# EasyEDA Pro project ProPrj_LuckfoxLyraLCD_2025-09-14.epro

# Schematic Schematic_luckfox_lyra
Board Name: LCDBoard_luckfox_lyra; Create Date: 2025-08-31; Page Name: LCD_driver; Project Name: LCDBoard4Rockchip; Schematic Name: Schematic_luckfox_lyra; Update Date: 2025-09-04; Company: 嘉立创EDA; Page Size: A4; Version: V1.0
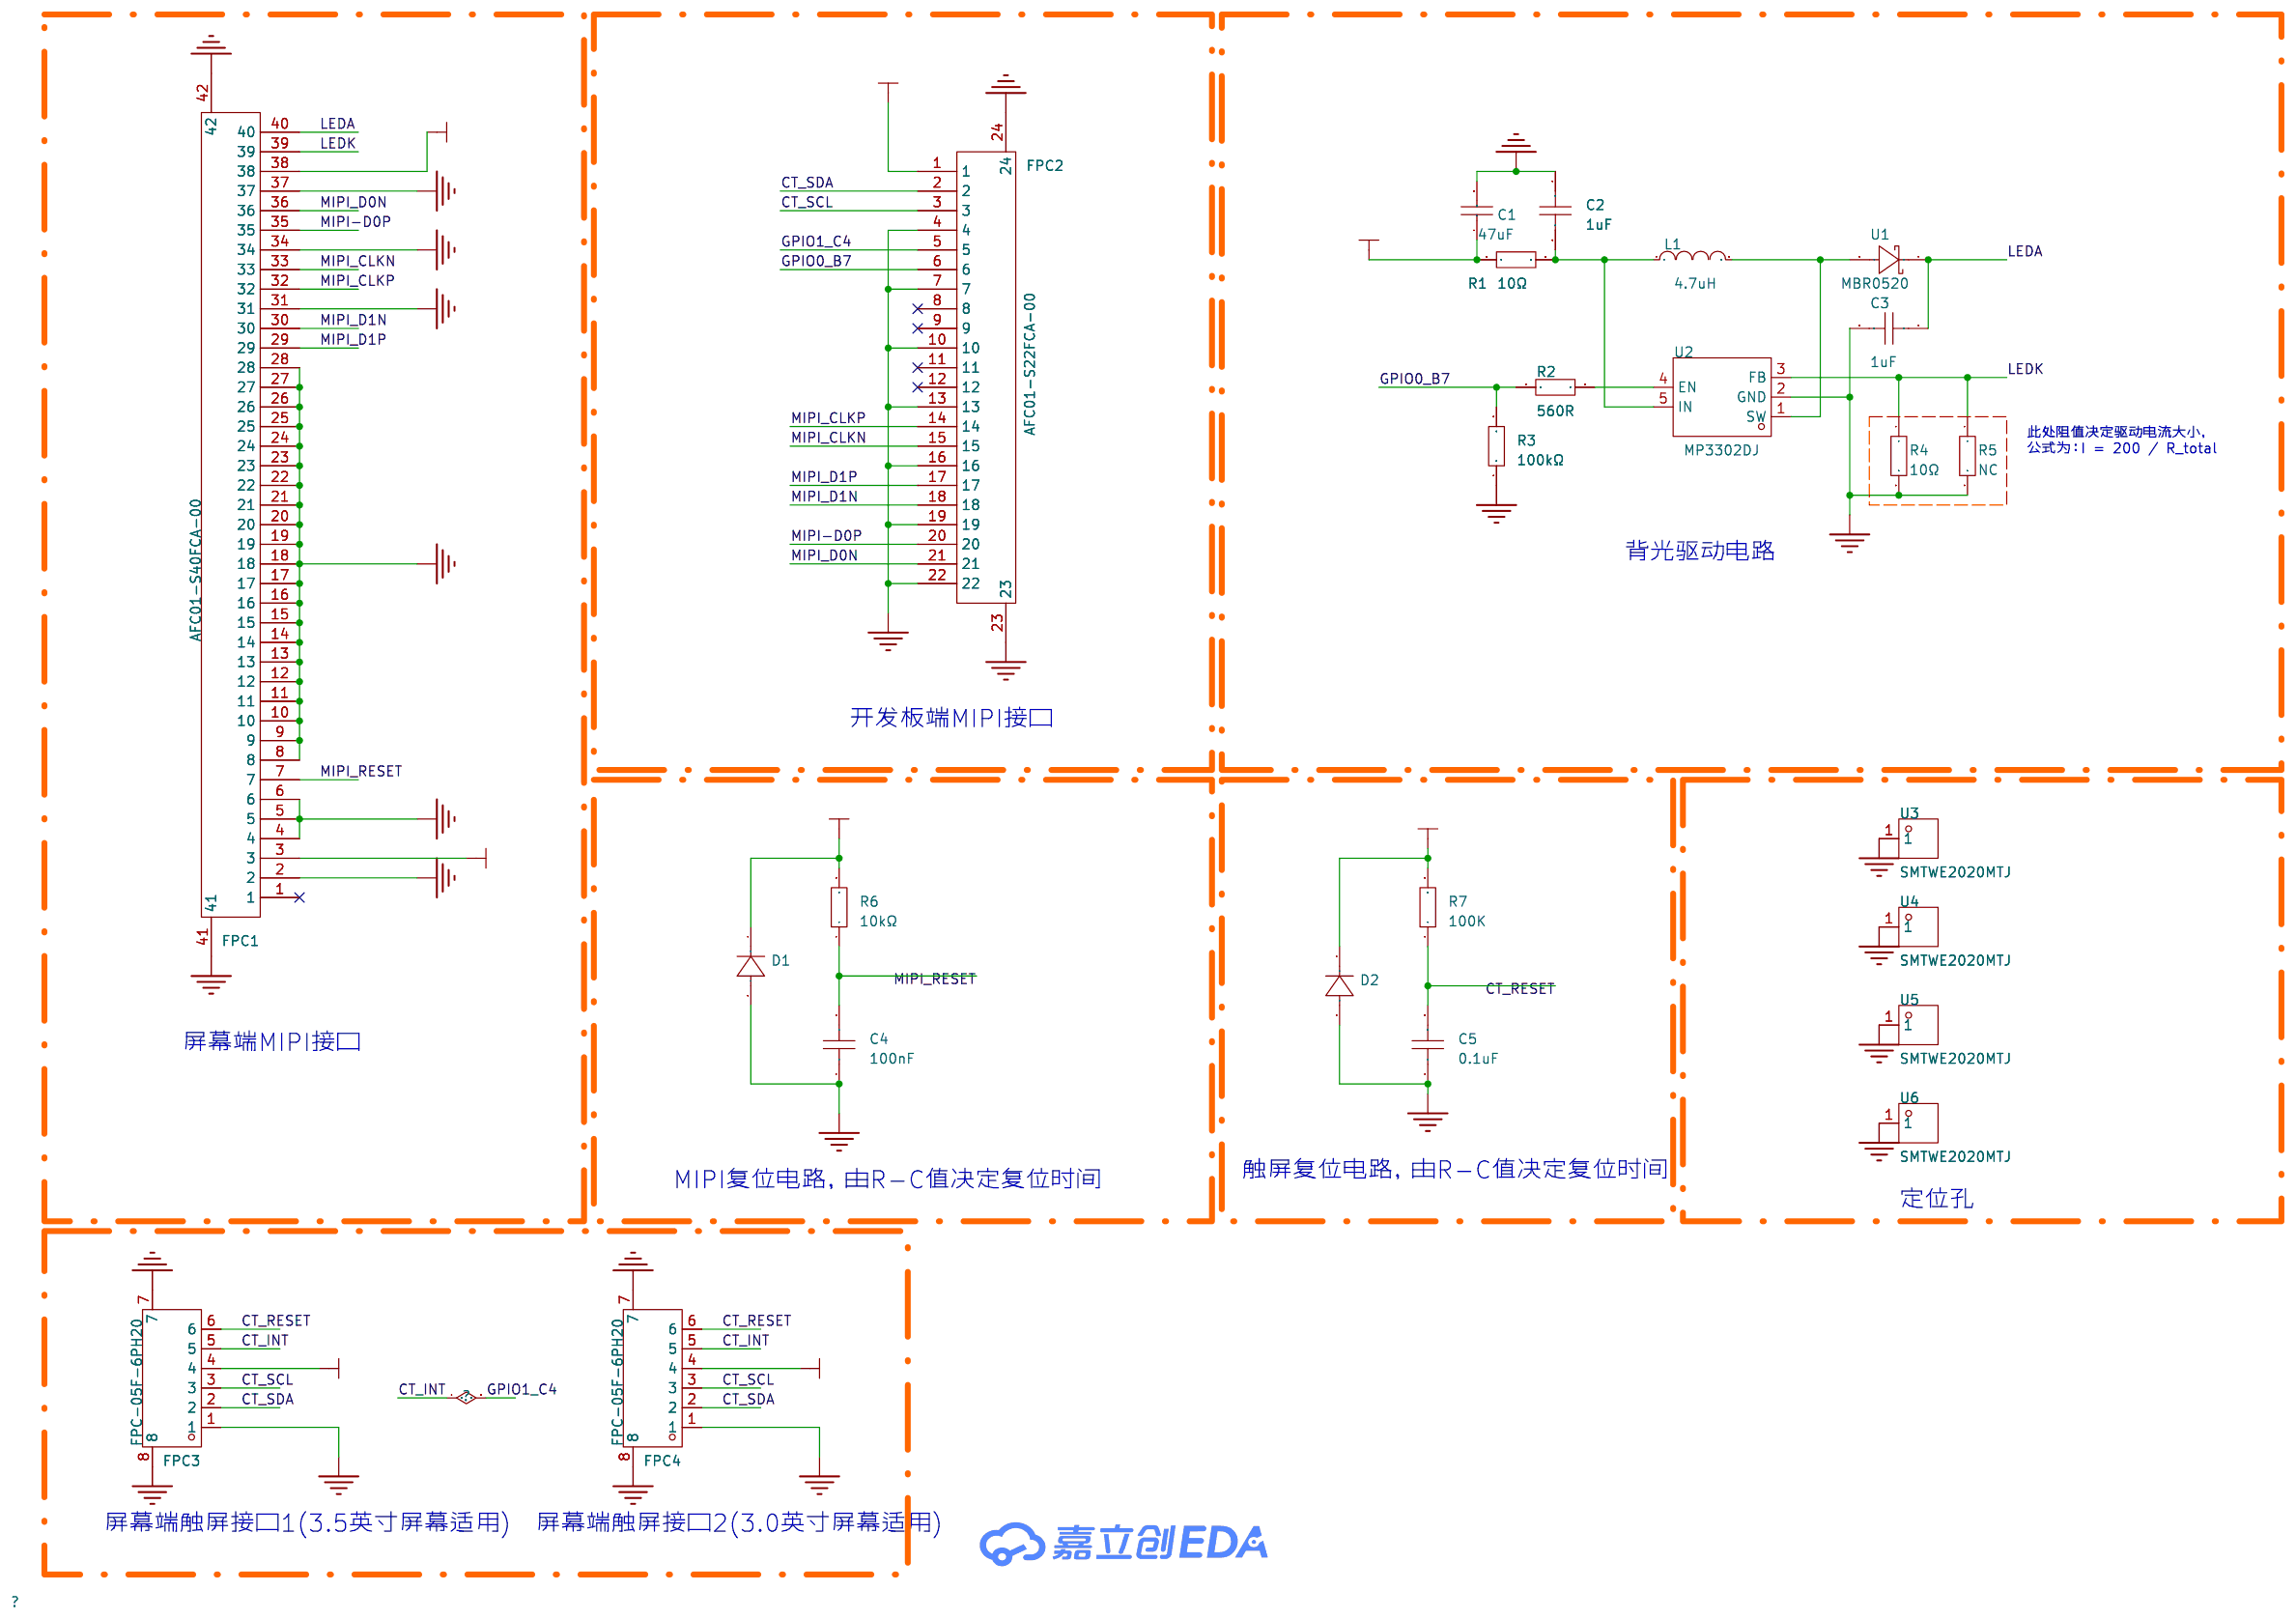
[diagram p0: schematic sheet]

## Parts
C1  47uF  [C0805]
C2  1uF  [C0805]
C3  1uF  [C0805]
C4  100nF  [C0603]
C5  0.1uF  [C0603]
D1  -  [SMA_1N4007]
D2  -  [SMA_1N4007]
FPC1  AFC01-S40FCA-00  [FPC-SMD_AFC01-S40FCA-00]
FPC2  AFC01-S22FCA-00  [FPC-SMD_P0.5-22P_FGS-XJ-H2.0]
FPC3  FPC-05F-6PH20  [FPC-SMD_6P-P0.50_XUNPU_FPC-05F-6PH20]
FPC4  FPC-05F-6PH20  [FPC-SMD_6P-P0.50_XUNPU_FPC-05F-6PH20]
L1  4.7uH  [IND-SMD_L4.0-W4.0_FNR40XXS]
R1  10Ω  [R1206]
R2  560R  [R0603]
R3  100kΩ  [R0603]
R4  10Ω  [R1206]
R5  10Ω  [R1206]
R6  10kΩ  [R0603]
R7  100K  [R0603]
U1  MBR0520  [SOD-123_L2.7-W1.6-LS3.7-RD-A]
U2  MP3302DJ  [TSOT-23-5_L2.9-W1.6-P0.95-LS2.8-BL]
U3  SMTWE2020MTJ  [SMD_BD4.4-L4.4-D2.8]
U4  SMTWE2020MTJ  [SMD_BD4.4-L4.4-D2.8]
U5  SMTWE2020MTJ  [SMD_BD4.4-L4.4-D2.8]
U6  SMTWE2020MTJ  [SMD_BD4.4-L4.4-D2.8]

## Library data of the parts
C1 = CL21A476MQYNNNE: 容值:47uF;精度:±20%;额定电压:6.3V;温度系数:X5R;; LCSC Part Name: 47uF ±20% 6.3V; Supplier Part: C16780; Manufacturer: SAMSUNG(三星); Supplier Footprint: 0805; JLCPCB Part Class: 基础库; Datasheet: https://item.szlcsc.com/datasheet/CL21A476MQYNNNE/17464.html; Supplier: LCSC; Tolerance: ±20%; Voltage Rating: 6.3V; Temperature Coefficient: X5R
C2 C3 = GRM219R7YA105KA12D: 容值:1uF;精度:±10%;额定电压:35V;材质(温度系数):X7R;; LCSC Part Name: 1uF ±10% 35V; Supplier Part: C440196; Manufacturer: muRata(村田); Supplier Footprint: 0805; JLCPCB Part Class: 扩展库; Datasheet: https://atta.szlcsc.com/upload/public/pdf/source/20191022/C440211_D691AF4420B7318595498C3E4B7F2331.pdf; Supplier: LCSC; Tolerance: ±10%; Voltage Rated: 35V; Temperature Coefficient: X7R
C4 C5 = CAP_0603: Supplier Footprint: 0603
D1 D2 = D_1N4007: Supplier Footprint: SMA
FPC1 = AFC01-S40FCA-00: 锁定特性:翻盖式;触点类型:下接;触点数量:40P;间距:0.5mm;安装方式:卧贴;; LCSC Part Name: 间距:0.5mm P数:40P 翻盖式 下接; Supplier Part: C262674; Manufacturer: JS(钜硕电子); Supplier Footprint: SMD,P=0.5mm,卧贴; JLCPCB Part Class: 扩展库; Datasheet: https://atta.szlcsc.com/upload/public/pdf/source/20250227/B3051E4C486C068BA33A463D5292C42F.pdf; Supplier: LCSC; Locking Feature: 翻盖式; Contact Type: 下接; Number of Contacts: 40P; Pitch: 0.5mm; Mounting Type: 卧贴; FFC, FCB Thickness: 0.3mm; Height Above Board: 2mm
FPC2 = AFC01-S22FCA-00: 锁定特性:翻盖式;触点类型:下接;触点数量:22P;间距:0.5mm;安装类型:卧贴;; LCSC Part Name: 间距:0.5mm P数:22P 翻盖式 下接; Supplier Part: C262668; Manufacturer: JS(钜硕电子); Supplier Footprint: SMD,P=0.5mm,卧贴; JLCPCB Part Class: 扩展库; Datasheet: https://atta.szlcsc.com/upload/public/pdf/source/20190816/C413942_2A72D1AC756EAE17EEDF756A339D4500.pdf; Supplier: LCSC; Locking Feature: 翻盖式; Contact Type: 下接; Number of Contacts: 22P; Pitch: 0.5mm; Mounting Type: 卧贴; FFC, FCB Thickness: 0.3mm; Height Above Board: 2mm
FPC3 FPC4 = FPC-05F-6PH20: 锁定特性:翻盖式;触点类型:下接;触点数量:6P;间距:0.5mm;安装类型:卧贴;工作温度范围:-25℃~+85℃;; LCSC Part Name: 间距:0.5mm P数:6P 翻盖式 下接; Supplier Part: C2856796; Manufacturer: XUNPU(讯普); Supplier Footprint: SMD,P=0.5mm,卧贴; JLCPCB Part Class: 扩展库; Datasheet: https://atta.szlcsc.com/upload/public/pdf/source/20210922/16B003FB53336DDF6538142CC465AC4D.pdf; Supplier: LCSC; Locking Feature: 翻盖式; Contact Type: 下接; Number of Contacts: 6P; Pitch: 0.5mm; Mounting Type: 卧贴; FFC, FCB Thickness: 0.3mm; Height Above Board: 2mm; Operating Temperature Range: -25℃~+85℃
L1 = FNR4030S4R7MT: 电感值:4.7uH;精度:±20%;额定电流:2.3A;饱和电流(Isat):3.2A;类型:磁胶屏蔽绕线合金电感;; LCSC Part Name: 4.7uH ±20% 3.2A; Supplier Part: C167874; Manufacturer: cjiang(长江微电); Supplier Footprint: SMD,4x4mm; JLCPCB Part Class: 扩展库; Datasheet: https://atta.szlcsc.com/upload/public/pdf/source/20190327/C167925_9EFF0AABC4CA629C2CC95961DBF7D39D.pdf; Supplier: LCSC; Tolerance: ±20%; Current Rating: 2.3A; Current - Saturation(Isat): 3.2A; DC Resistance(DCR): 78mΩ; Type: 磁胶屏蔽绕线合金电感
R1 R4 R5 = RC1206FR-0710RL: 电阻类型:厚膜电阻;阻值:10Ω;精度:±1%;功率:250mW;最大工作电压:200V;温度系数:±200ppm/℃;; LCSC Part Name: 厚膜电阻 10Ω ±1% 250mW; Supplier Part: C108080; Manufacturer: YAGEO(国巨); Supplier Footprint: 1206; JLCPCB Part Class: 扩展库; Datasheet: https://atta.szlcsc.com/upload/public/pdf/source/20180821/C275644_0D56F95EFF785E7D9A1FEF436B37DA78.pdf; Supplier: LCSC; Type: 厚膜电阻; Tolerance: ±1%; Power(Watts): 250mW; Overload Voltage (Max): 200V; Temperature Coefficient: ±200ppm/℃; Operating Temperature Range: -55℃~+155℃
R2 R6 R7 = 0603WAF1002T5E: 电阻类型:厚膜电阻;阻值:10kΩ;精度:±1%;功率:100mW;工作电压:75V;温度系数:±100ppm/℃;; LCSC Part Name: 厚膜电阻 10kΩ ±1% 100mW; Supplier Part: C25804; Manufacturer: UNI-ROYAL(厚声); Supplier Footprint: 0603; JLCPCB Part Class: 基础库; Datasheet: https://item.szlcsc.com/datasheet/0603WAF1002T5E/26547.html; Supplier: LCSC; Type: 厚膜电阻; Tolerance: ±1%; Power(Watts): 100mW; Voltage-Supply(Max): 75V; Temperature Coefficient: ±100ppm/℃; Operating Temperature: -55℃~+155℃
R3 = 0603WAF1003T5E: 电阻类型:厚膜电阻;阻值:100kΩ;精度:±1%;功率:100mW;工作电压:75V;温度系数:±100ppm/℃;; LCSC Part Name: 100kΩ ±1% 100mW 厚膜电阻; Supplier Part: C25803; Manufacturer: UNI-ROYAL(厚声); Supplier Footprint: 0603; JLCPCB Part Class: 基础库; Datasheet: https://item.szlcsc.com/datasheet/0603WAF1003T5E/26546.html; Supplier: LCSC; Type: 厚膜电阻; Tolerance: ±1%; Power(Watts): 100mW; Voltage-Supply(Max): 75V; Temperature Coefficient: ±100ppm/℃; Operating Temperature: -55℃~+155℃
U1 = MBR0520_C5204745: 二极管配置:独立式;正向压降(Vf):440mV@0.5A;直流反向耐压(Vr):20V;整流电流:500mA;; LCSC Part Name: 电压:20V 电流:500mA; Supplier Part: C5204745; Manufacturer: TWGMC(台湾迪嘉); Supplier Footprint: SOD-123; JLCPCB Part Class: 扩展库; Datasheet: https://item.szlcsc.com/datasheet/MBR0520/5894894.html; Supplier: LCSC; Diode Configuration: 独立式; Voltage - Forward(Vf@If): 440mV@0.5A; Voltage - DC Reverse(Vr): 20V; Current - Rectified: 500mA; Reverse Leakage Current (Ir): 150uA; Non-Repetitive Peak Forward Surge Current: 5.5A
U2 = MP3302DJ: Supplier Part: C9900002157; Supplier Footprint: TSOT-23-5; JLCPCB Part Class: 扩展库; Supplier: LCSC
U3-U6 = SMTWE2020MTJ: M2x4.35xL2+1.4; LCSC Part Name: 雄和远景，电路板表贴圆螺母柱，M2X2，铁镀锡,1个; Supplier Part: C2928177; Manufacturer: Sinhoo(雄和远景); JLCPCB Part Class: 扩展库; Datasheet: https://atta.szlcsc.com/upload/public/pdf/source/20211216/9F87D56F723C430AF11DB5F4781E386A.pdf; Supplier: LCSC; surface treatment: 镀锡; Product Description: M2*4.35*2+1.4; brand: Sinhoo(雄和远景)

## Nets
GND: C1.2 C2.1 C3.2 C4.1 C5.1 D1.2(A) D2.2(A) FPC1.2 FPC1.4 FPC1.5 FPC1.6 FPC1.8 FPC1.9 FPC1.10 FPC1.11 FPC1.12 FPC1.13 FPC1.14 FPC1.15 FPC1.16 FPC1.17 FPC1.18 FPC1.19 FPC1.20 FPC1.21 FPC1.22 FPC1.23 FPC1.24 FPC1.25 FPC1.26 FPC1.27 FPC1.28 FPC1.31 FPC1.34 FPC1.37 FPC1.41 FPC1.42 FPC2.4 FPC2.7 FPC2.10 FPC2.13 FPC2.16 FPC2.19 FPC2.22 FPC2.23 FPC2.24 FPC3.1 FPC3.7 FPC3.8 FPC4.1 FPC4.7 FPC4.8 R3.1 R4.2 R5.2 U2.2(GND) U3.1 U4.1 U5.1 U6.1
VCC+3V3: C1.1 D1.1(K) D2.1(K) FPC1.3 FPC1.38 FPC2.1 FPC3.4 FPC4.4 R1.1 R6.2 R7.2
CT_INT: FPC2.5 FPC3.5 FPC4.5
CT_RESET: C5.2 FPC3.6 FPC4.6 R7.1
CT_SCL: FPC2.3 FPC3.3 FPC4.3
CT_SDA: FPC2.2 FPC3.2 FPC4.2
GPIO0_B7: FPC2.6 R2.1 R3.2
LEDA: C3.1 FPC1.40 U1.1(K)
LEDK: FPC1.39 R4.1 R5.1 U2.3(FB)
MIPI-D0P: FPC1.35 FPC2.20
MIPI_CLKN: FPC1.33 FPC2.15
MIPI_CLKP: FPC1.32 FPC2.14
MIPI_D0N: FPC1.36 FPC2.21
MIPI_D1N: FPC1.30 FPC2.18
MIPI_D1P: FPC1.29 FPC2.17
MIPI_RESET: C4.2 FPC1.7 R6.1
$1N3962: L1.2 U1.2(A) U2.1(SW)
$1N3968: R2.2 U2.4(EN)
$1N3975: C2.2 L1.1 R1.2 U2.5(IN)

Not connected (* = marked no-connect by the designer): FPC1 1*; FPC2 8* 9* 11* 12*

## Notes on the sheet
- 此处阻值决定驱动电流大小，
  公式为：I = 200 / R_total
- 背光驱动电路
- 开发板端MIPI接口
- 屏幕端MIPI接口
- 触屏复位电路，由R-C值决定复位时间
- MIPI复位电路，由R-C值决定复位时间
- 定位孔
- 屏幕端触屏接口1(3.5英寸屏幕适用)
- 屏幕端触屏接口2(3.0英寸屏幕适用)

# Board PCB_luckfox_lyra
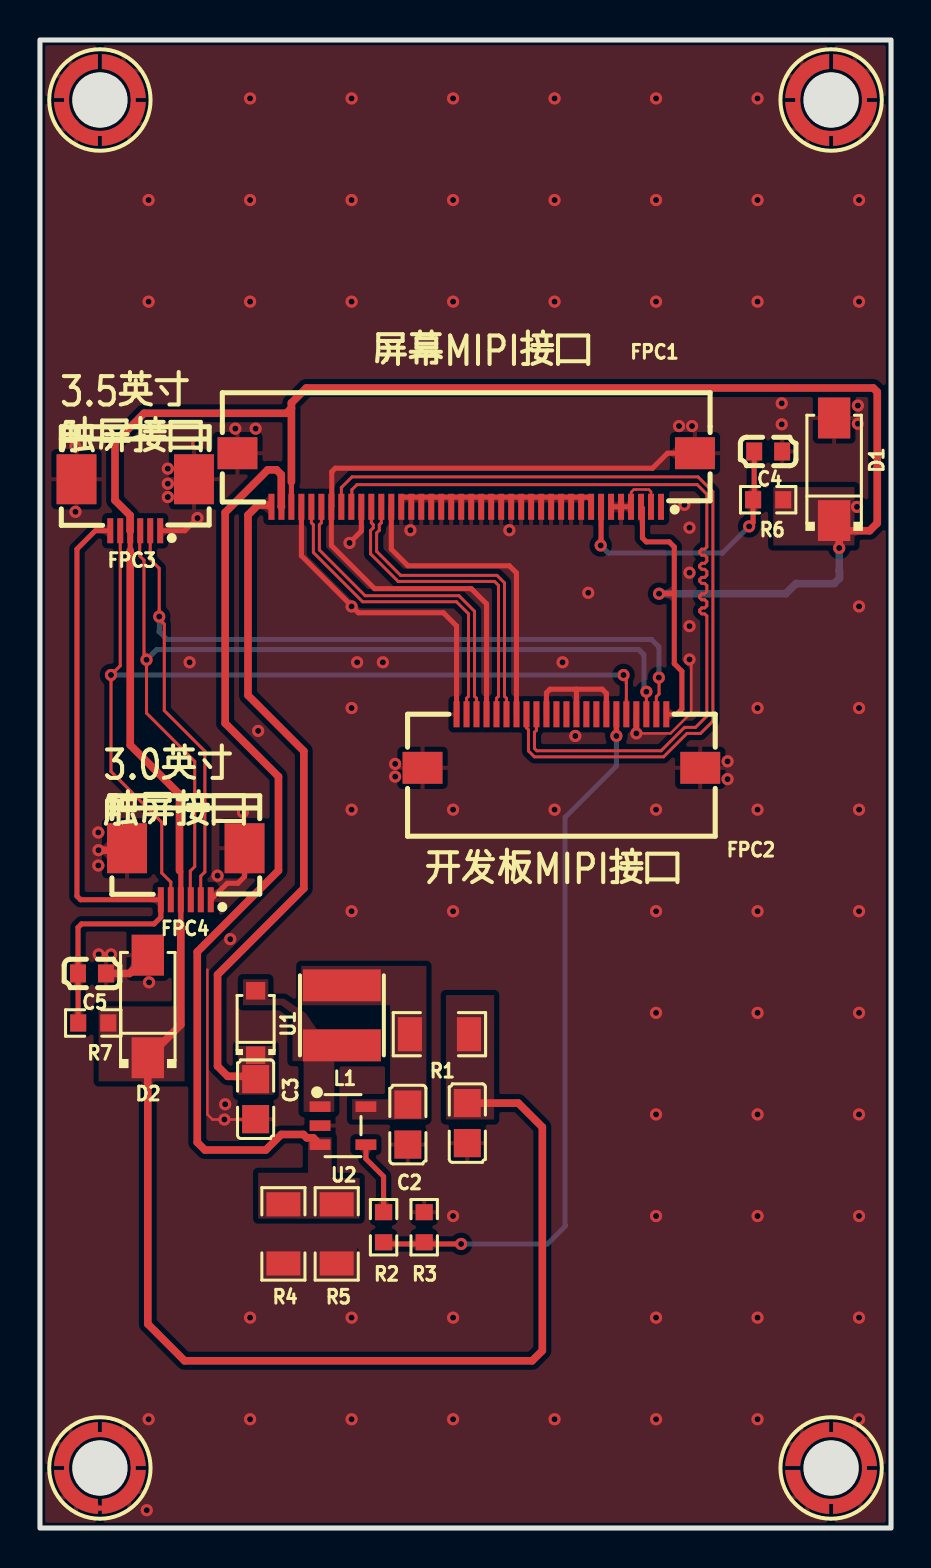
[diagram p1: board, top side]
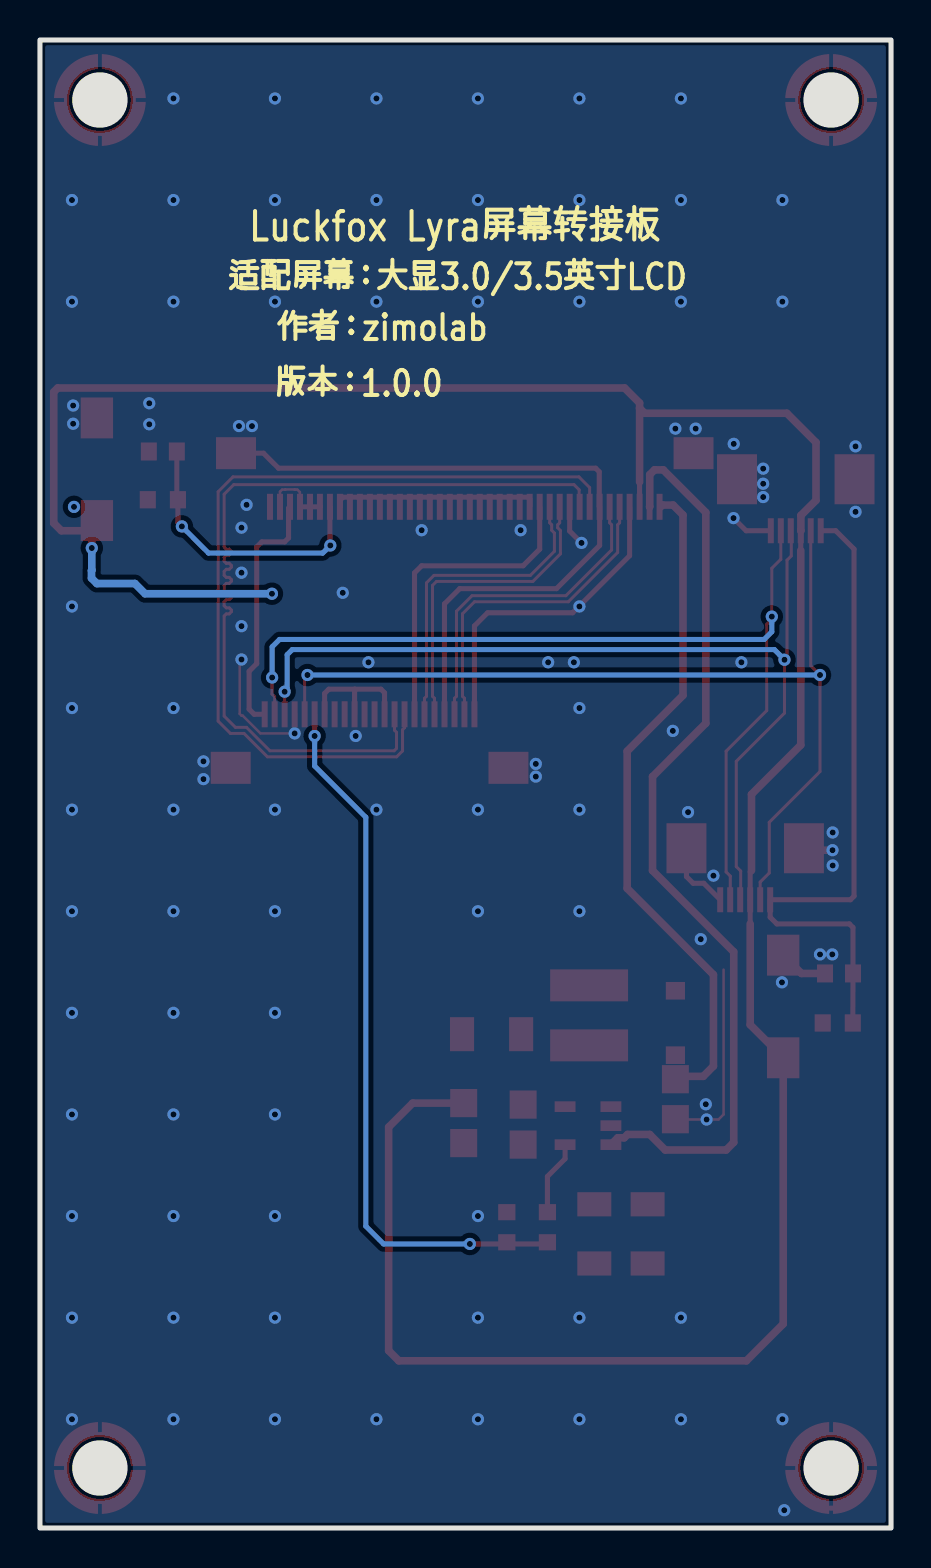
[diagram p2: board, bottom side, seen from below]

Outline 42.6 x 74.4 mm; copper layers: Top Layer, Bottom Layer. Coordinates in mm from the lower left corner of the outline.
Outline path: rectangle 0,74.4 42.6,0
Stack: Top Layer 0.035mm / Dielectric1 1.51mm FR4 er 4.5 / Bottom Layer 0.035mm

## Design rules (mm)
net MIPI_D1P: DP2
net MIPI_D1N: DP2
net MIPI_CLKP: DP3
net MIPI_CLKN: DP3
net MIPI-D0P: DP1
net MIPI_D0N: DP1
template: JLCPCB Capability(Two Layers Board)
spacing copperThickness1oz (default): track to track 0.102, other pairs 0.152 to 0.3
spacing copperThickness2oz: track to track 0.203, other pairs 0.152 to 0.3
track width copperThickness1oz (default): min 0.127, default 0.254, max 2.54
track width copperThickness2oz: min 0.203, default 0.254, max 2.54
differential pair differentialPair (default): width min 0.127, default 0.254, max 2.54; gap min 0.152, default 0.152
via viaSize (default): diameter min 0.5, default 0.61, max 10; hole min 0.3, default 0.305, max 6.3

## Placement (name value [footprint] x y rotation side)
C1  47uF  [C0805]  21.39 20.25 270 top
C2  1uF  [C0805]  18.41 20.17 90 top
C3  1uF  [C0805]  10.79 21.44 270 top
C4  100nF  [C0603]  36.45 53.83 180 top
C5  0.1uF  [C0603]  2.6 27.73 180 top
D1  -  [SMA_1N4007]  39.75 52.94 90 top
D2  -  [SMA_1N4007]  5.4 26.08 90 top
FPC1  AFC01-S40FCA-00  [FPC-SMD_AFC01-S40FCA-00]  21.34 52.4 180 top
FPC2  AFC01-S22FCA-00  [FPC-SMD_P0.5-22P_FGS-XJ-H2.0]  26.1 39.35 180 top
FPC3  FPC-05F-6PH20  [FPC-SMD_6P-P0.50_XUNPU_FPC-05F-6PH20]  4.77 51.15 180 top
FPC4  FPC-05F-6PH20  [FPC-SMD_6P-P0.50_XUNPU_FPC-05F-6PH20]  7.3 32.7 180 top
L1  4.7uH  [IND-SMD_L4.0-W4.0_FNR40XXS]  15.11 25.63 270 top
R1  10Ω  [R1206]  19.99 24.69 180 top
R2  560R  [R0603]  17.2 15.04 90 top
R3  100kΩ  [R0603]  19.23 15.04 270 top
R4  10Ω  [R1206]  12.19 14.71 270 top
R5  10Ω  [R1206]  14.85 14.71 270 top
R6  10kΩ  [R0603]  36.45 51.41 0 top
R7  100K  [R0603]  2.67 25.25 0 top
U1  MBR0520  [SOD-123_L2.7-W1.6-LS3.7-RD-A]  10.79 25.25 90 top
U2  MP3302DJ  [TSOT-23-5_L2.9-W1.6-P0.95-LS2.8-BL]  15.17 20.12 270 top
U3  SMTWE2020MTJ  [SMD_BD4.4-L4.4-D2.8]  3 71.4 0 top
U4  SMTWE2020MTJ  [SMD_BD4.4-L4.4-D2.8]  39.6 71.4 0 top
U5  SMTWE2020MTJ  [SMD_BD4.4-L4.4-D2.8]  3 3 0 top
U6  SMTWE2020MTJ  [SMD_BD4.4-L4.4-D2.8]  39.6 3 0 top

## Footprints (pads in the part's own frame, mm; a bottom-side part is the same pattern mirrored in y, then rotated)
C0603
  rect 0.8x0.9 smd: 1(-0.7,0) 2(0.7,0)
C0805
  rect 1.41x1.35 smd: 1(-1,0) 2(1,0)
FPC-SMD_6P-P0.50_XUNPU_FPC-05F-6PH20
  rect 0.3x1.25 smd: 1(-1.25,1.288) 2(-0.75,1.288) 3(-0.25,1.288) 4(0.25,1.288) 5(0.75,1.288) 6(1.25,1.288)
  rect 2x2.5 smd: 7(2.94,-1.288) 8(-2.94,-1.288)
FPC-SMD_AFC01-S40FCA-00
  rect 0.3x1.3 smd: 1(-9.75,1.34) 2(-9.25,1.339) 3(-8.75,1.34) 4(-8.25,1.34) 5(-7.75,1.34) 6(-7.25,1.34) 7(-6.75,1.34) 8(-6.25,1.34) 9(-5.75,1.34) 10(-5.25,1.34) 11(-4.75,1.34) 12(-4.25,1.34) 13(-3.75,1.34) 14(-3.25,1.34) 15(-2.75,1.34) 16(-2.25,1.34) 17(-1.75,1.34) 18(-1.25,1.34) 19(-0.75,1.34) 20(-0.25,1.34) 21(0.25,1.34) 22(0.75,1.34) 23(1.25,1.34) 24(1.75,1.34) 25(2.25,1.34) 26(2.75,1.34) 27(3.25,1.34) 28(3.75,1.34) 29(4.25,1.34) 30(4.75,1.34) 31(5.25,1.34) 32(5.75,1.34) 33(6.25,1.34) 34(6.75,1.34) 35(7.25,1.34) 36(7.75,1.34) 37(8.25,1.34) 38(8.75,1.34) 39(9.25,1.34) 40(9.75,1.34)
  rect 2x1.6 smd: 41(-11.45,-1.34) 42(11.45,-1.34)
FPC-SMD_P0.5-22P_FGS-XJ-H2.0
  rect 0.3x1.3 smd: 1(-5.252,-1.338) 2(-4.752,-1.338) 3(-4.252,-1.338) 4(-3.752,-1.338) 5(-3.252,-1.338) 6(-2.752,-1.338) 7(-2.252,-1.338) 8(-1.752,-1.338) 9(-1.25,-1.339) 10(-0.752,-1.338) 11(-0.252,-1.338) 12(0.248,-1.338) 13(0.748,-1.338) 14(1.248,-1.338) 15(1.748,-1.338) 16(2.248,-1.338) 17(2.748,-1.338) 18(3.248,-1.338) 19(3.748,-1.338) 20(4.25,-1.339) 21(4.748,-1.338) 22(5.248,-1.338)
  rect 2x1.6 smd: 23(6.95,1.339) 24(-6.95,1.339)
IND-SMD_L4.0-W4.0_FNR40XXS
  rect 1.6x3.9 smd: 1(-1.5,0) 2(1.5,0)
R0603
  rect 0.806x0.864 smd: 1(-0.753,0) 2(0.753,0)
R1206
  rect 1.208x1.701 smd: 1(-1.479,0) 2(1.479,0)
SMA_1N4007
  rect 2.046x1.62 smd: 1(-2.566,0) 2(2.566,0)
SMD_BD4.4-L4.4-D2.8
  custom 2.2x2.2 smd: 1(-1.474,1.196) 1(-1.196,-1.474) 1(1.196,1.474) 1(1.474,-1.196)
SOD-123_L2.7-W1.6-LS3.7-RD-A
  rect 0.88x0.96 smd: 1(-1.61,0) 2(1.61,0)
TSOT-23-5_L2.9-W1.6-P0.95-LS2.8-BL
  rect 0.532x1.045 smd: 1(-0.95,-1.147) 2(0,-1.147) 3(0.95,-1.147) 4(0.95,1.147) 5(-0.95,1.147)

## Nets
As in the schematic.

Pads without a net: FPC1 1; FPC2 8 9 11 12

## Via types
v1: diameter 0.61, hole 0.305, Top Layer to Bottom Layer, 122 vias

## Routing (per net, layer and track width the routed paths; a pad name or vN(x,y) marks a point on that pad's centre or on a via; arc(x,y) is an arc through that point)
GND: length 155.4
  Top Layer w0.127: FPC1.4 29.59,51.07 29.59,51.79 29.72,51.92 29.84,51.92 29.85,51.93 30.32,51.93 30.33,51.92 30.48,51.92 30.59,51.82 FPC1.2 ; 8.38,27.92 8.38,20.68 8.64,20.43 v1(9.23,20.43) 10.78,20.43 C3.2 ; v1(29.85,39.73) 31.56,39.73 32.45,40.62 32.51,40.62 32.6,40.71 32.6,43.34 v1(32.51,43.43)
  Top Layer w0.254: 1.53,2.11 1.53,1.8 U5.1 ; 1.53,2.11 1.33,2.31 1.33,3.69 1.53,3.89 U5.1 1.84,4.2 2.31,4.67 4,4.67 U5.1 4.67,4 4.67,2.31 4.47,2.11 U5.1 ; 1.53,2.11 2.65,0.99 3.05,0.99 ; FPC1.6 FPC1.5 29.46,51.06 ; FPC2.16 23.85,47.75 23.5,48.11 18.41,48.11 17.59,48.94 FPC1.28 ; FPC1.41 31.41,53.74 30.66,52.99 14.78,52.99 14.6,52.81 14.6,51.08 FPC1.34 14.59,49.13 16.75,46.97 21.59,46.97 22.35,46.21 FPC2.19 ; U3.1 4.67,72.4 4.67,70.71 4.47,70.51 U3.1 4,69.73 2.31,69.73 2.11,69.93 U3.1 1.8,70.24 1.33,70.71 1.33,72.4 U3.1 ; FPC2.7 28.35,41.73 28.14,41.94 26.84,41.94 ; FPC2.22 20.85,45.1 20.19,45.76 15.94,45.76 13.09,48.61 FPC1.37 ; FPC1.27 18.09,51.47 18.16,51.54 27.43,51.54 27.59,51.39 FPC1.8 ; FPC2.10 26.85,41.93 26.84,41.94 ; FPC4.1 9.37,32.24 9.91,32.24 10.24,32.57 FPC4.8 ; U6.1 38.4,4.47 38.71,4.47 38.91,4.67 40.29,4.67 40.49,4.47 U6.1 41.07,4.2 41.07,3.89 41.27,3.69 41.27,2.31 41.07,2.11 U6.1 40.8,1.53 40.49,1.53 40.29,1.33 38.91,1.33 38.71,1.53 U6.1 ; v1(15.49,49.25) 16.09,49.85 FPC1.31 ; FPC2.13 25.35,41.76 25.53,41.94 26.84,41.94 ; v1(7.89,50.5) 7.25,49.86 FPC3.1 ; U4.1 41.27,72.4 41.27,70.71 41.07,70.51 U4.1 40.6,69.73 38.91,69.73 38.71,69.93 U4.1 38.4,70.24 37.93,70.71 37.93,72.4 U4.1 ; FPC2.4 v1(29.85,39.73) ; v1(2.94,28.68) v1(3.56,28.68)
  Top Layer w0.381: v1(2.93,33.89) 4.26,33.89 FPC4.7 ; C5.1 4.48,27.73 D2.2
  vias: v1(1.78,54.08) v1(1.78,50.81) v1(2.92,34.78) v1(2.92,33.12) v1(5.35,0.89) v1(5.44,66.4) v1(5.44,61.32) v1(5.44,5.44) v1(5.46,27.28) v1(6.4,52.97) v1(6.4,52.21) v1(6.4,51.55) v1(7.49,43.29) v1(7.87,54.21) v1(8.89,32.62) v1(9.27,21.19) v1(9.53,29.44) v1(9.78,54.97) v1(10.16,35.79) v1(10.52,71.48) v1(10.52,66.4) v1(10.52,61.32) v1(10.52,10.52) v1(10.52,5.44) v1(10.79,54.97) v1(10.92,39.86) v1(15.6,71.48) v1(15.6,66.4) v1(15.6,61.32) v1(15.6,46.08) v1(15.6,41) v1(15.6,35.92) v1(15.6,30.84) v1(15.6,10.52) v1(15.6,5.44) v1(15.88,43.29) v1(17.16,43.29) v1(17.78,38.21) v1(17.78,37.57) v1(18.54,49.89) v1(20.68,71.48) v1(20.68,66.4) v1(20.68,61.32) v1(20.68,35.92) v1(20.68,30.84) v1(20.68,15.6) v1(20.68,10.52) v1(20.68,5.44) v1(23.5,49.89) v1(25.76,71.48) v1(25.76,66.4) v1(25.76,61.32) v1(25.76,35.92) v1(25.76,5.44) v1(26.16,43.29) v1(26.8,39.6) v1(27.44,46.76) v1(30.84,71.48) v1(30.84,66.4) v1(30.84,61.32) v1(30.84,35.92) v1(30.84,30.84) v1(30.84,25.76) v1(30.84,20.68) v1(30.84,15.6) v1(30.84,10.52) v1(30.84,5.44) v1(31.99,55.1) v1(32.26,51.16) v1(32.51,50.02) v1(32.51,47.76) v1(32.51,45.09) v1(32.64,55.1) v1(34.42,38.33) v1(34.42,37.44) v1(35.92,71.48) v1(35.92,66.4) v1(35.92,61.32) v1(35.92,41) v1(35.92,35.92) v1(35.92,30.84) v1(35.92,25.76) v1(35.92,20.68) v1(35.92,15.6) v1(35.92,10.52) v1(35.92,5.44) v1(37.13,56.24) v1(37.13,55.18) v1(40.94,56.12) v1(40.94,55.21) v1(41,66.4) v1(41,61.32) v1(41,46.08) v1(41,41) v1(41,35.92) v1(41,30.84) v1(41,25.76) v1(41,20.68) v1(41,15.6) v1(41,10.52) v1(41,5.44)
VCC+3V3: length 161.1
  Top Layer w0.254: 4.52,48.87 FPC3.4 ; 31.75,46.72 30.99,46.72 v1(30.99,46.71) ; 31.75,46.72 31.75,43.22 32.13,42.84 32.13,40.94 31.88,40.69 FPC2.1 ; 31.75,46.72 31.75,49.05 31.5,49.31 30.35,49.31 30.16,49.5 30.16,50.99 FPC1.3 ; 7.05,30.2 FPC4.4 7.05,32.81 6.99,32.87 ; 12.59,52.3 FPC1.38
  Top Layer w0.381: D1.1 40,50.12 ; 40,50.12 40.26,49.86 41.53,49.86 41.91,50.24 41.91,56.8 41.71,57 13.34,57 12.59,56.25 12.59,55.99 ; 40,50.12 v1(40,49) ; 4.52,48.87 4.52,39.15 6.99,36.68 6.99,32.87 ; 12.59,55.99 12.33,55.74 5.21,55.74 3.76,54.28 3.76,51.38 4.51,50.63 4.51,49.87 FPC3.4 ; 12.59,55.99 12.59,52.3 ; C1.1 23.94,21.25 25.15,20.04 25.15,8.87 24.64,8.36 7.24,8.36 5.4,10.2 D2.1 7.05,25.16 7.05,30.2
  Bottom Layer w0.381: v1(30.99,46.71) 37.34,46.71 37.85,47.22 39.75,47.22 40.02,47.49 40.02,47.87 40,47.89 v1(40,49)
  vias: v1(40.9,51.06)
CT_INT: length 47.6
  Top Layer w0.15: FPC2.5 29.35,42.51 v1(29.21,42.65)
  Top Layer w0.152: FPC4.5 6.55,32.3 6.1,32.75 6.1,35.28 3.56,37.82 v1(3.56,42.65) 4.02,43.11 FPC3.5
  Bottom Layer w0.254: v1(3.56,42.65) v1(29.21,42.65)
CT_RESET: length 33.7
  Top Layer w0.254: R7.1 C5.2 1.91,30.02 2.08,30.2 5.72,30.2 6.05,30.54 FPC4.6 2.03,31.41 1.85,31.59 1.85,48.95 2.77,49.86 FPC3.6
CT_SCL: length 47.8
  Top Layer w0.15: v1(5.33,43.41) 5.33,40.75 7.75,38.33 7.75,33.07 7.53,32.85 7.53,31.88 7.55,31.86 FPC4.3 ; 30.35,40.69 30.35,41.63
  Top Layer w0.152: FPC3.3 4.99,49.84 4.99,48.6 5.21,48.39 5.21,43.54 v1(5.33,43.41)
  Bottom Layer w0.254: v1(5.33,43.41) 5.84,43.92 29.97,43.92 30.23,43.67 30.23,41.81 v1(30.35,41.81)
CT_SDA: length 49.2
  Top Layer w0.15: FPC2.2 30.85,41.56 30.99,41.7 30.99,42.51 v1(30.98,42.52)
  Top Layer w0.152: FPC4.2 8.05,31.42 8.05,32.59 8.25,32.8 8.25,38.84 6.22,40.87 6.22,45.19 5.97,45.44 v1(5.97,45.57) 5.97,47.98 5.52,48.43 FPC3.2
  Bottom Layer w0.254: v1(30.98,42.52) 30.98,44.06 30.61,44.43 6.35,44.43 5.97,44.81 v1(5.97,45.57)
GPIO0_B7: length 36.1
  Top Layer w0.254: v1(21.08,14.2) 17.54,14.2 17.45,14.28 R2.1 ; FPC2.6 v1(28.85,39.6)
  Bottom Layer w0.254: v1(28.85,39.6) 28.85,38.1 26.29,35.54 26.29,15.09 25.4,14.2 v1(21.08,14.2)
LEDA: length 34.1
  Top Layer w0.152: 11.53,51.06 FPC1.40
  Top Layer w0.381: C3.1 10.65,22.58 9.4,22.58 8.89,23.09 8.89,27.66 13.21,31.98 13.21,38.84 10.41,41.63 10.41,50.65 10.91,51.15 11.44,51.15 11.53,51.06
LEDK: length 46.5
  Top Layer w0.381: U2.3 13.68,19.51 13.36,19.51 13.19,19.68 12.08,19.68 11.3,18.9 8.25,18.9 7.87,19.28 7.87,28.81 11.94,32.87 11.94,37.57 9.27,40.24 9.27,50.78 11.4,52.91 11.84,52.91 12.08,52.67 12.08,51.07 FPC1.39
MIPI-D0P: length 16.4
  Top Layer w0.15: FPC1.35 14.09,50.26 13.99,50.16 13.99,48.9 16.28,46.61 20.97,46.61 21.75,45.84 21.75,41.59 21.85,41.49 FPC2.20
MIPI_CLKN: length 43.5
  Top Layer w0.15: FPC1.33 15.09,52.02 15.62,52.56 32.94,52.56 33.68,51.81 33.68,40.34 33.07,39.73 32.38,39.73 31.22,38.56 24.75,38.56 24.45,38.85 24.45,39.91 24.35,40.01 FPC2.15
MIPI_CLKP: length 43.5
  Top Layer w0.15: FPC2.14 24.85,39.89 24.75,39.79 24.75,38.98 24.87,38.86 31.09,38.86 32.26,40.03 32.81,40.03 33.38,40.6 33.38,45.6 33.27,45.71 33.13,45.71 33.02,45.81 33.02,45.9 33.13,46.01 33.27,46.01 33.38,46.11 33.38,46.31 33.27,46.41 33.13,46.41 33.02,46.52 33.02,46.61 33.13,46.71 33.27,46.71 33.38,46.82 33.38,47.12 33.27,47.23 33.13,47.23 33.02,47.34 33.02,47.42 33.13,47.53 33.27,47.53 33.38,47.64 33.38,47.83 33.27,47.94 33.13,47.94 33.02,48.04 33.02,48.13 33.13,48.23 33.27,48.23 33.38,48.34 33.38,48.54 33.27,48.64 33.13,48.64 33.02,48.75 33.02,48.83 33.13,48.94 33.27,48.94 33.38,49.05 33.38,51.69 32.9,52.17 15.87,52.17 15.61,51.91 15.61,51.55 15.59,51.53 FPC1.32
MIPI_D0N: length 16.4
  Top Layer w0.15: FPC1.36 13.59,50.26 13.69,50.16 13.69,48.78 16.15,46.31 20.85,46.31 21.45,45.71 21.45,41.58 21.35,41.49 FPC2.21
MIPI_D1N: length 16
  Top Layer w0.15: FPC1.30 16.59,50.26 16.69,50.16 16.69,50.01 16.55,49.88 16.55,48.71 17.93,47.33 22.75,47.33 22.95,47.13 22.95,41.58 22.85,41.49 FPC2.18
MIPI_D1P: length 16
  Top Layer w0.15: FPC1.29 17.09,50.26 16.99,50.16 16.99,49.89 16.85,49.75 16.85,48.83 18.05,47.63 22.88,47.63 23.25,47.26 23.25,41.58 23.35,41.49 FPC2.17
MIPI_RESET: length 13.9
  Top Layer w0.254: v1(35.5,50.08) 35.7,50.28 R6.1 35.75,51.47 35.75,53.83 ; v1(28.07,49.13) 28.09,49.15 FPC1.7
  Bottom Layer w0.254: v1(28.07,49.13) 28.45,48.75 34.16,48.75 v1(35.5,50.08)
$1N3968: length 3.7
  Top Layer w0.254: U2.4 16.32,18.46 17.2,17.58 17.2,15.79

## Copper pours and planes (outline as drawn; the poured copper is in the pictures)
GND on Top Layer: 0,74.56 42.6,74.56 42.6,0 0,0
GND on Top Layer: 10.79,14.2 15.88,14.2 15.88,11.92 10.79,11.92
GND on Bottom Layer: -0.13,74.91 43.18,74.91 43.18,-0.66 -0.13,-0.66
VCC+3V3 on Top Layer: 20.32,26.65 22.73,26.65 22.73,20.43 20.32,20.43
VCC+3V3 on Top Layer: 36.7,52.05 40.77,52.05 40.77,49.13 36.7,49.13
VCC+3V3 on Top Layer: 2.94,26.08 7.24,26.08 7.24,22.33 2.94,22.33
LEDA on Top Layer: 9.91,24.11 11.7,24.11 11.7,21.66 9.91,21.66
LEDK on Top Layer: 10.92,19.54 16,19.54 16,15.47 10.92,15.47
$1N3962 on Top Layer: 13.2,24.87 14.73,24.87 14.73,20.81 13.2,20.81
$1N3962 on Top Layer: 10.16,27.44 15.52,27.44 15.52,23.35 10.16,23.35
$1N3975 on Top Layer: 13.08,28.11 19.34,28.11 19.34,20.43 13.08,20.43
$1N3975 on Top Layer: 15.62,21.44 17.85,21.44 17.85,20.42 15.62,20.42

Small or netless copper shapes (teardrops, artwork), in the pictures only: 108 on Top Layer, 12 on Bottom Layer

## Text on the board
Bottom Silkscreen Layer: 适配屏幕：大显3.0/3.5英寸LCD | 作者：zimolab | 版本：1.0.0 | Luckfox Lyra屏幕转接板
Top Silkscreen Layer: 开发板MIPI接口 | 3.5英寸 / 触屏接口 | 3.0英寸 / 触屏接口 | 屏幕MIPI接口
